# Altium schematic sheet Hot_Water_Dispensar.SchDoc
size A3
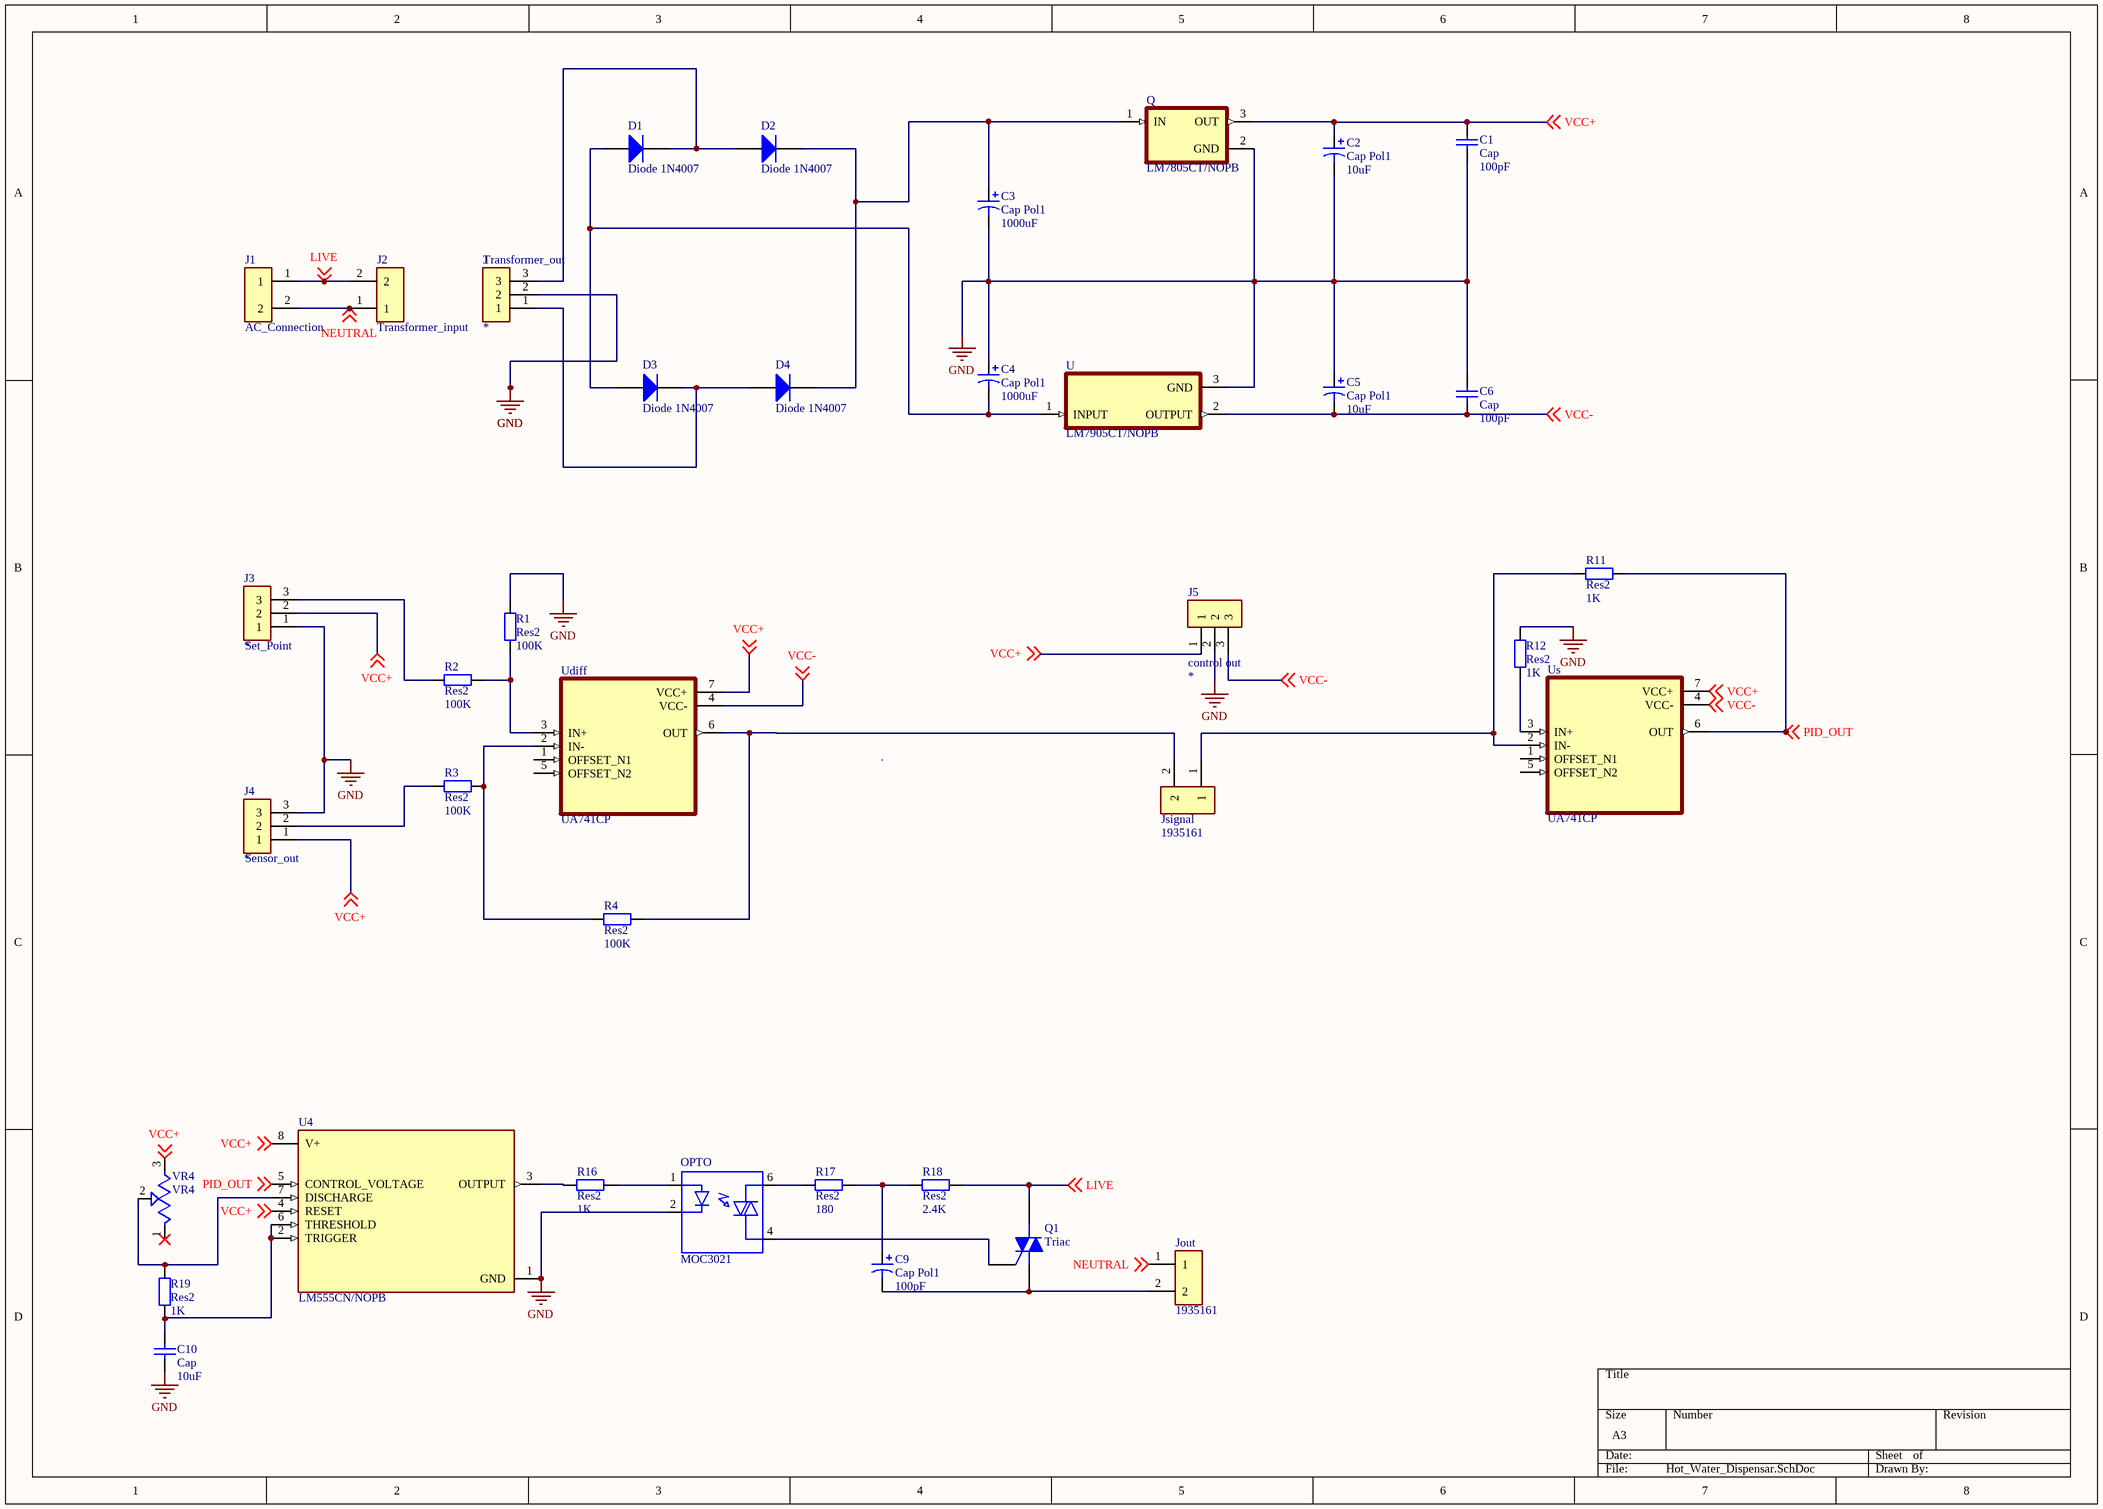
[diagram p0: Hot_Water_Dispensar.SchDoc]

## Parts
C1  Cap  value 100pF  [RAD-0.3]
C2  Cap Pol1  value 10uF  [RB7.6-15]
C3  Cap Pol1  value 1000uF  [RB7.6-15]
C4  Cap Pol1  value 1000uF  [RB7.6-15]
C5  Cap Pol1  value 10uF  [RB7.6-15]
C6  Cap  value 100pF  [RAD-0.3]
C9  Cap Pol1  value 100pF  [RB7.6-15]
C10  Cap  value 10uF  [RAD-0.3]
D1  Diode 1N4007  [DO-41]
D2  Diode 1N4007  [DO-41]
D3  Diode 1N4007  [DO-41]
D4  Diode 1N4007  [DO-41]
J  Transformer_out  [TE_282837-3]
J1  AC_Connection  [PHOENIX_1935161]
J2  Transformer_input  [PHOENIX_1935161]
J3  Set_Point  [TE_282837-3]
J4  Sensor_out  [TE_282837-3]
J5  control out  [TE_282837-3]
Jout  1935161  [PHOENIX_1935161]
Jsignal  1935161  [PHOENIX_1935161]
OPTO  MOC3021  [DIP762W45P254L889H508Q6]
Q  LM7805CT/NOPB  [TO254P1054X470X2600-3]
Q1  Triac  [369-03]
R1  Res2  value 100K  [AXIAL-0.4]
R2  Res2  value 100K  [AXIAL-0.4]
R3  Res2  value 100K  [AXIAL-0.4]
R4  Res2  value 100K  [AXIAL-0.4]
R11  Res2  value 1K  [AXIAL-0.4]
R12  Res2  value 1K  [AXIAL-0.4]
R16  Res2  value 1K  [AXIAL-0.4]
R17  Res2  value 180  [AXIAL-0.4]
R18  Res2  value 2.4K  [AXIAL-0.4]
R19  Res2  value 1K  [AXIAL-0.4]
U  LM7905CT/NOPB  [TO254P1054X470X1955-3]
U4  LM555CN/NOPB  [DIP794W45P254L959H508Q8]
Udiff  UA741CP  [DIP794W45P254L959H508Q8]
Us  UA741CP  [DIP794W45P254L959H508Q8]
VR4  VR4  [TRIM_3296W-1-100]

## Nets
GND: C1.2 C2.2 C3.2 C4.1 C5.1 C6.1 C10.1 J.2 J3.1 J4.3 J5.2 OPTO.2(CATODE) Q.2(GND) R1.2 R12.2 U.3(GND) U4.1(GND)
LIVE: J1.1 J2.2 Q1.2(M2) R18.1 ; off-sheet LIVE
NEUTRAL: J1.2 J2.1 Jout.1 ; off-sheet NEUTRAL
PID_OUT: R11.1 U4.5(CONTROL_VOLTAGE) Us.6(OUT) ; off-sheet PID_OUT
VCC+: C1.1 C2.1 J3.2 J4.1 J5.1 Q.3(OUT) U4.4(RESET) U4.8(V+) Udiff.7(VCC+) Us.7(VCC+) VR4.3(CW) ; off-sheet VCC+
VCC-: C5.2 C6.2 J5.3 U.2(OUTPUT) Udiff.4(VCC-) Us.4(VCC-) ; off-sheet VCC-
NetC3_1: C3.1 D2.2(K) D4.2(K) Q.1(IN)
NetC4_2: C4.2 D1.1(A) D3.1(A) U.1(INPUT)
NetC9_1: C9.1 R17.1 R18.2
NetC9_2: C9.2 Jout.2 Q1.1(M1)
NetC10_2: C10.2 R19.1 U4.2(TRIGGER) U4.6(THRESHOLD)
NetD1_2: D1.2(K) D2.1(A) J.3
NetD3_2: D3.2(K) D4.1(A) J.1
NetJ3_3: J3.3 R2.1
NetJ4_2: J4.2 R3.1
NetJsignal_1: Jsignal.1 R11.2 Us.2(IN-)
NetJsignal_2: Jsignal.2 R4.2 Udiff.6(OUT)
NetOPTO_1: OPTO.1(ANODE) R16.2
NetOPTO_4: OPTO.4(MAIN_TERM2) Q1.3(G)
NetOPTO_6: OPTO.6(MAIN_TERM1) R17.2
NetR1_1: R1.1 R2.2 Udiff.3(IN+)
NetR3_2: R3.2 R4.1 Udiff.2(IN-)
NetR12_1: R12.1 Us.3(IN+)
NetR16_1: R16.1 U4.3(OUTPUT)
NetR19_2: R19.2 U4.7(DISCHARGE) VR4.2(WIPER)

Not connected (* = marked no-connect by the designer): Udiff 1(OFFSET_N1) 5(OFFSET_N2); Us 1(OFFSET_N1) 5(OFFSET_N2); VR4 1(CCW)*

## Library data of the parts
C1 C6 C10 = Cap: Capacitor; Published: 8-Jun-2000; LatestRevisionDate: 17-Jul-2002; LatestRevisionNote: Re-released for DXP Platform.; PackageReference: RAD-0.3; Publisher: Altium Limited; PackageDescription: Radial Cap, Thru-Hole; 2 Leads; 0.3 in Pin Spacing
C2-C5 C9 = Cap Pol1: Polarized Capacitor (Radial); Published: 8-Jun-2000; LatestRevisionDate: 17-Jul-2002; LatestRevisionNote: Re-released for DXP Platform.; PackageReference: RB7.6-15; Publisher: Altium Limited; PackageDescription: Polarized Capacitor (Radial); 2 Leads
D1-D4 = Diode 1N4007: 1 Amp General Purpose Rectifier; Published: 8-Jun-2000; LatestRevisionDate: 17-Jul-2002; LatestRevisionNote: Re-released for DXP Platform.; DatasheetVersion: 1998; PackageVersion: Aug-1999; PackageReference: DO-41; Publisher: Altium Limited; PackageDescription: Diode, Axial; Body 5.2 x 2.7 mm (LxDia. max), Lead Dia. 0.86 mm (max); Code_JEDEC: DO-204-AL; ComponentLink1Description: Manufacturer Link; ComponentLink1URL: http://www.fairchildsemi.com/; ComponentLink2Description: Datasheet; ComponentLink2URL: http://www.fairchildsemi.com/ds/1N%2F1N4001.pdf
J J3-J5 = 282837-3: Wire to Board 3 Position 5.08 mm Pitch 30-16 AWG Euro Style Terminal Block; MF: TE Connectivity; Value: 3pin; Package: None; Digi-Key_Part_Number: A113321-ND; MP: 282837-3; TE_purchase_URL: https://www.te.com/usa-en/product-282837-3.html?te_bu=Cor&te_type=disp&te_campaign=seda_glo_cor-seda-global-disp-prtnr-fy19-seda-model-bom-cta_sma-317_1&elqCampaignId=32493; SnapEDA_Link: https://www.snapeda.com/parts/282837-3/TE%20Connectivity%20AMP%20Connectors/view-part/2765182/?ref=snap; Digi-Key_Purchase_URL: https://www.digikey.in/product-detail/en/te-connectivity-amp-connectors/282837-3/A113321-ND/2187974?utm_source=snapeda&utm_medium=aggregator&utm_campaign=symbol; Comment_1: *
J1 J2 Jout Jsignal = 1935161: 2 Position Wire to Board Terminal Block Horizontal with Board 0.197 _5.00mm_ Through Hole; MF: Phoenix Contact; SnapEDA_Link: https://www.snapeda.com/parts/1935161/Phoenix%20Contact/view-part/423515/?ref=snap; MP: 1935161; Value: *; Digi-Key_Purchase_URL: https://www.digikey.ca/product-detail/en/phoenix-contact/1935161/277-1667-ND/568614?utm_source=snapeda&utm_medium=aggregator&utm_campaign=symbol; Digi-Key_Part_Number: 277-1667-ND; Package: None
OPTO = MOC3021: Optoisolator Triac Output 5000Vrms 1 Channel 6-DIP; MF: Lite-On; MP: MOC3021; SnapEDA_Link: https://www.snapeda.com/parts/MOC3021/Lite-On/view-part/4551083/?ref=snap; Availability: Unavailable; Package: DIP-6 Lite-On; Value: *; Price: None
Q = LM7805CT/NOPB: Linear Voltage Regulator IC 1 Output 1A TO-220-3; MF: ON Semiconductor; MP: LM7805CT; SnapEDA_Link: https://www.snapeda.com/parts/LM7805CT/ON%20Semiconductor/view-part/546231/?ref=snap; Price: None; Package: TO-220 ON Semiconductor; Value: *; Availability: Unavailable
Q1 = Triac: Silicon Bidirectional Triode Thyristor; Note: Pin 2 is electrically connected to Pin 4 (TAB); Published: 29-Sep-2000; LatestRevisionDate: 17-Jul-2002; LatestRevisionNote: Re-released for DXP Platform.; DatasheetVersion: 1999; PackageReference: 369-03; Publisher: Altium Limited; PackageDescription: TO, Thru-Hole, Vertical, Heatsink Mounted; 3 In-Line Leads; Pitch 2.28 mm; ComponentLink1Description: Manufacturer Link; ComponentLink1URL: http://www.motorola.com/
R1-R4 R11 R12 R16-R19 = Res2: Resistor; Published: 8-Jun-2000; LatestRevisionDate: 17-Jul-2002; LatestRevisionNote: Re-released for DXP Platform.; PackageReference: AXIAL-0.4; Publisher: Altium Limited; PackageDescription: Axial Device, Thru-Hole; 2 Leads; 0.4 in Pin Spacing
U = LM7905CT/NOPB: 1.5-A, negative linear voltage regulator 3-TO-220 0 to 125; pin to pad: 1>2 2>3 3>1; MF: Texas Instruments; Value: *; Mouser-Purchase-URL: https://snapeda.com/shop?store=Mouser&id=6864; MP: LM7905CT/NOPB; DigiKey-Purchase-URL: https://snapeda.com/shop?store=DigiKey&id=6864; Package: TO-220-3 Texas Instruments; Price: None; Texas_Instruments-Purchase-URL: https://snapeda.com/shop?store=Texas+Instruments&id=6864; SnapEDA_Link: https://www.snapeda.com/parts/LM7905CT/NOPB/Texas%20Instruments/view-part/6864/?ref=snap; Availability: Unavailable
Udiff Us = UA741CP: General-Purpose Operational Amplifier; MF: Texas Instruments; Price: None; Package: PDIP-8 Texas Instruments; Texas_Instruments-Purchase-URL: https://snapeda.com/shop?store=Texas+Instruments&id=50768; Availability: Unavailable; MP: UA741CP; Value: *; SnapEDA_Link: https://www.snapeda.com/parts/UA741CP/Texas%20Instruments/view-part/50768/?ref=snap
VR4 = 3296W-1-100: 10 Ohms 0.5W, 1/2W PC Pins Through Hole Trimmer Potentiometer Cermet 25 Turn Top Adjustment; MF: Bourns; Mouser-Purchase-URL: https://snapeda.com/shop?store=Mouser&id=1463245; Value: *; SnapEDA_Link: https://www.snapeda.com/parts/3296W-1-100/Bourns/view-part/1463245/?ref=snap; MP: 3296W-1-100; Package: SOT-23-5 Bourns; Digi-Key_Part_Number: 3296W-100LF-ND
U4 = LM555CN/NOPB: Value: *; Availability: Unavailable; Package: None; MP: LM555CN/NOPB; Price: None